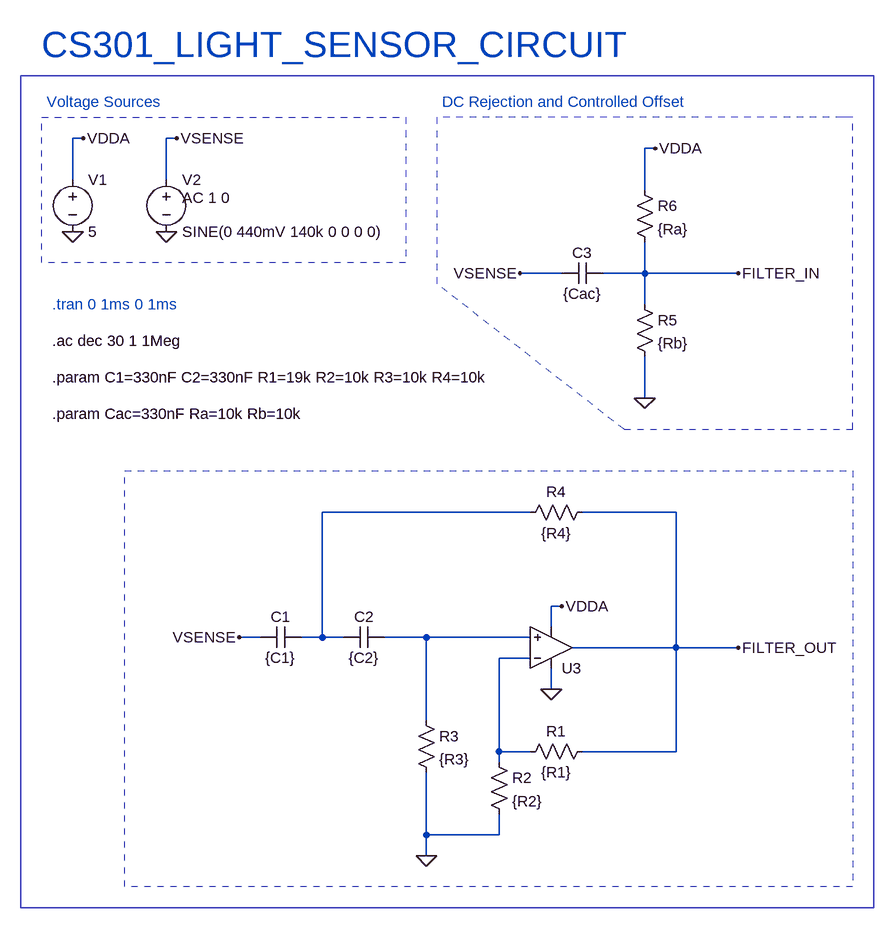
[diagram p0: schematic LightSense.asc]
LightSense.asc, the LTspice schematic file:
Version 4
SHEET 1 880 680
WIRE -1216 -720 -1232 -720
WIRE -1072 -720 -1088 -720
WIRE -336 -704 -352 -704
WIRE -1232 -656 -1232 -720
WIRE -1088 -656 -1088 -720
WIRE -352 -640 -352 -704
WIRE -480 -512 -544 -512
WIRE -352 -512 -352 -560
WIRE -352 -512 -416 -512
WIRE -208 -512 -352 -512
WIRE -352 -464 -352 -512
WIRE -352 -320 -352 -384
WIRE -528 -144 -848 -144
WIRE -304 -144 -448 -144
WIRE -480 0 -496 0
WIRE -496 32 -496 0
WIRE -944 48 -976 48
WIRE -848 48 -848 -144
WIRE -848 48 -880 48
WIRE -816 48 -848 48
WIRE -688 48 -752 48
WIRE -528 48 -688 48
WIRE -304 64 -304 -144
WIRE -304 64 -464 64
WIRE -208 64 -304 64
WIRE -528 80 -576 80
WIRE -496 128 -496 96
WIRE -688 176 -688 48
WIRE -576 224 -576 80
WIRE -528 224 -576 224
WIRE -304 224 -304 64
WIRE -304 224 -448 224
WIRE -576 240 -576 224
WIRE -688 352 -688 256
WIRE -576 352 -576 320
WIRE -576 352 -688 352
WIRE -688 384 -688 352
FLAG -1232 -576 0
FLAG -1216 -720 VDDA
FLAG -496 128 0
FLAG -480 0 VDDA
FLAG -208 64 FILTER_OUT
FLAG -976 48 VSENSE
FLAG -1088 -576 0
FLAG -1072 -720 VSENSE
FLAG -688 384 0
FLAG -352 -320 0
FLAG -336 -704 VDDA
FLAG -544 -512 VSENSE
FLAG -208 -512 FILTER_IN
SYMBOL voltage -1232 -672 R0
WINDOW 123 0 0 Left 0
WINDOW 39 0 0 Left 0
SYMATTR InstName V1
SYMATTR Value 5
SYMBOL res -704 160 R0
SYMATTR InstName R3
SYMATTR Value {R3}
SYMBOL res -432 -160 R90
WINDOW 0 0 56 VBottom 2
WINDOW 3 32 56 VTop 2
SYMATTR InstName R4
SYMATTR Value {R4}
SYMBOL cap -752 32 R90
WINDOW 0 0 32 VBottom 2
WINDOW 3 32 32 VTop 2
SYMATTR InstName C2
SYMATTR Value {C2}
SYMBOL cap -880 32 R90
WINDOW 0 0 32 VBottom 2
WINDOW 3 32 32 VTop 2
SYMATTR InstName C1
SYMATTR Value {C1}
SYMBOL voltage -1088 -672 R0
WINDOW 123 24 44 Left 2
WINDOW 39 0 0 Left 0
SYMATTR Value2 AC 1 0
SYMATTR InstName V2
SYMATTR Value SINE(0 440mV 140k 0 0 0 0)
SYMBOL res -592 224 R0
SYMATTR InstName R2
SYMATTR Value {R2}
SYMBOL res -432 208 R90
WINDOW 0 0 56 VBottom 2
WINDOW 3 32 56 VTop 2
SYMATTR InstName R1
SYMATTR Value {R1}
SYMBOL OpAmps\\UniversalOpamp2 -496 64 M180
SYMATTR InstName U3
SYMBOL res -368 -480 R0
SYMATTR InstName R5
SYMATTR Value {Rb}
SYMBOL res -368 -656 R0
SYMATTR InstName R6
SYMATTR Value {Ra}
SYMBOL cap -416 -528 R90
WINDOW 0 0 32 VBottom 2
WINDOW 3 32 32 VTop 2
SYMATTR InstName C3
SYMATTR Value {Cac}
TEXT -1264 -464 Left 2 ;.tran 0 1ms 0 1ms
TEXT -1264 -408 Left 2 !.ac dec 30 1 1Meg
TEXT -1264 -352 Left 2 !.param C1=330nF C2=330nF R1=19k R2=10k R3=10k R4=10k
TEXT -1264 -296 Left 2 !.param Cac=330nF Ra=10k Rb=10k
TEXT -1272 -776 Left 2 ;Voltage Sources
TEXT -1280 -864 Left 5 ;CS301_LIGHT_SENSOR_CIRCUIT
TEXT -664 -776 Left 2 ;DC Rejection and Controlled Offset
LINE Normal -384 -272 -672 -496 2
LINE Normal -672 -752 -672 -496 2
LINE Normal -48 -752 -672 -752 2
LINE Normal -32 -752 -48 -752 2
LINE Normal -32 -272 -32 -752 2
LINE Normal -384 -272 -32 -272 2
RECTANGLE Normal -720 -528 -1280 -752 2
RECTANGLE Normal -32 432 -1152 -208 2
RECTANGLE Normal 0 464 -1312 -816

The netlist it stands for:
* LightSense.asc
V1 VDDA 0 5
R3 N002 0 {R3}
R4 FILTER_OUT N001 {R4}
C2 N002 N001 {C2}
C1 N001 VSENSE {C1}
V2 VSENSE 0 SINE(0 440mV 140k 0 0 0 0) AC 1 0
R2 N003 0 {R2}
R1 FILTER_OUT N003 {R1}
XU3 N002 N003 0 VDDA FILTER_OUT level.2 Avol=1Meg GBW=10Meg Slew=10Meg ilimit=25m rail=0 Vos=0 phimargin=45 en=0 enk=0 in=0 ink=0 Rin=500Meg  ; pins IN+ IN- V+ V- OUT
R5 FILTER_IN 0 {Rb}
R6 VDDA FILTER_IN {Ra}
C3 FILTER_IN VSENSE {Cac}
* .tran 0 1ms 0 1ms
.ac dec 30 1 1Meg
.param C1=330nF C2=330nF R1=19k R2=10k R3=10k R4=10k
.param Cac=330nF Ra=10k Rb=10k
* Voltage Sources
* CS301_LIGHT_SENSOR_CIRCUIT
* DC Rejection and Controlled Offset
.lib UniversalOpamps2.sub
.backanno
.end